# EAGLE design AutoPilotBoard (EAGLE 7.4.0)
DESIGNER: Ye Wang; VERSION: 1.1
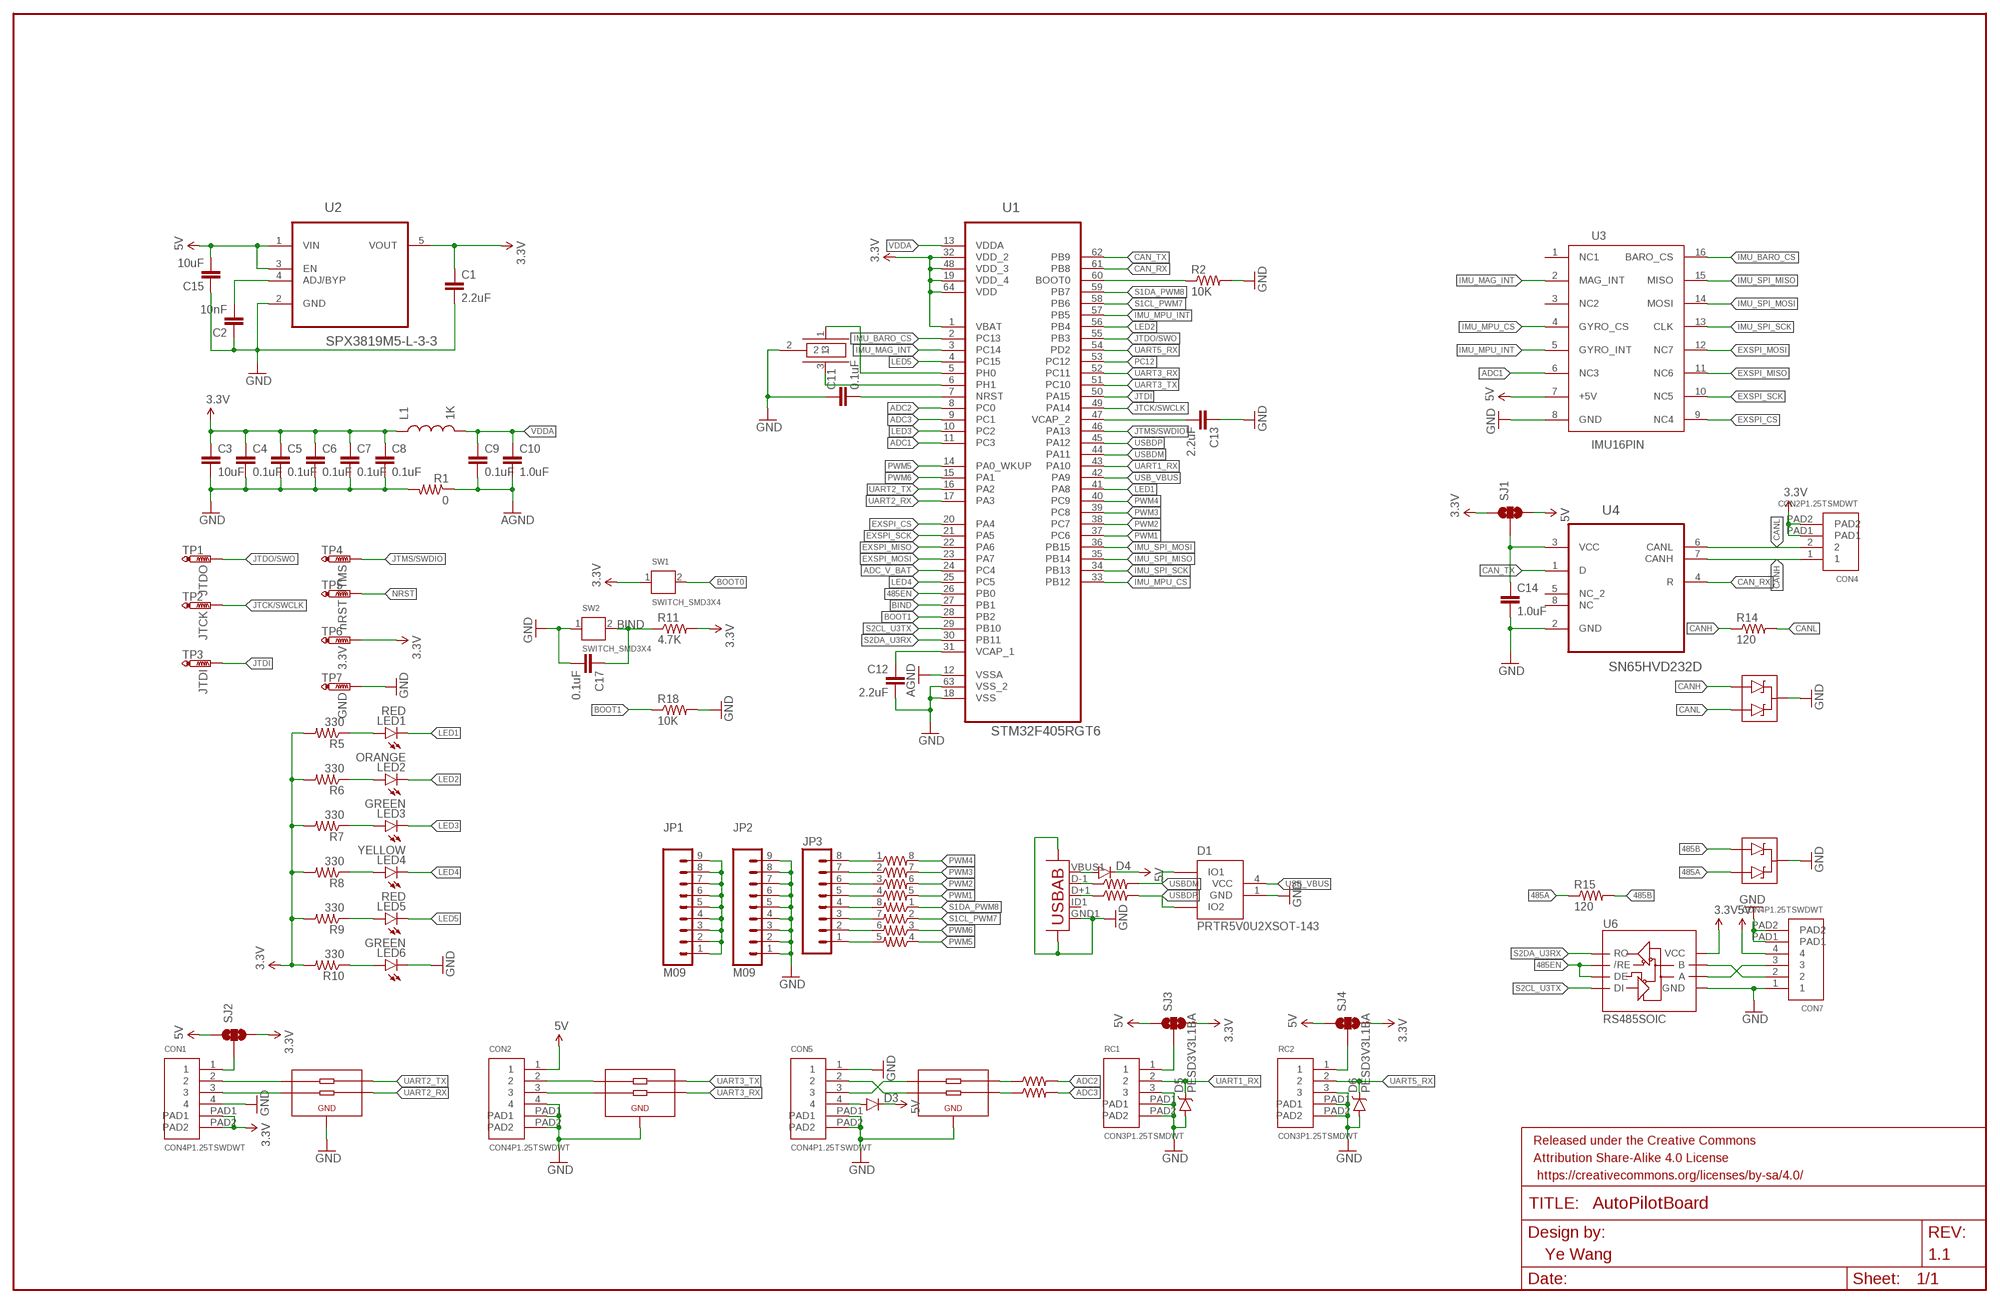
[diagram p0: schematic, sheet 1]

## Parts
C1  2.2uF  2.2UF-10V-20%(0603)  [0603-CAP]
C2  10nF  10NF/10000PF-50V-10%(0603)  [0603-CAP]
C3  10uF  CAP0805W  [0805-CAP]
C4  0.1uF  0.1UF-25V-5%(0603)  [0603-CAP]
C5  0.1uF  0.1UF-25V-5%(0603)  [0603-CAP]
C6  0.1uF  0.1UF-25V-5%(0603)  [0603-CAP]
C7  0.1uF  0.1UF-25V-5%(0603)  [0603-CAP]
C8  0.1uF  0.1UF-25V-5%(0603)  [0603-CAP]
C9  0.1uF  0.1UF-25V-5%(0603)  [0603-CAP]
C10  1.0uF  1.0UF-16V-10%(0603)  [0603-CAP]
C11  0.1uF  0.1UF-25V-5%(0603)  [0603-CAP]
C12  2.2uF  2.2UF-10V-20%(0603)  [0603-CAP]
C13  2.2uF  2.2UF-10V-20%(0603)  [0603-CAP]
C14  1.0uF  1.0UF-16V-10%(0603)  [0603-CAP]
C15  10uF  CAP1206  [1206]
C17  0.1uF  0.1UF-25V-5%(0603)  [0603-CAP]
CON1  CON4P1.25TSWDWT  [1.25T4P]
CON2  CON4P1.25TSWDWT  [1.25T4P]
CON4  CON2P1.25TSMDWT  [1.25T2P]
CON5  CON4P1.25TSWDWT  [1.25T4P]
CON7  CON4P1.25TSWDWT  [1.25T4P]
D1  PRTR5V0U2XSOT-143  [SOT-143B]
D2  PESD1CAN  MMBZ27VCLT1SOT23-3  [SOT23-3]
D3  DIODESOD123  [SOD-123]
D4  DIODESOD123  [SOD-123]
D5  PESD3V3L1BA  DIODE-SCHOTTKY-PMEG4005EJ  [SOD-323]
D6  PESD3V3L1BA  DIODE-SCHOTTKY-PMEG4005EJ  [SOD-323]
D7  SM712  MMBZ27VCLT1SOT23-3  [SOT23-3]
FIL1  IP4256CZ5-W  [SOT65P210X110-5N]
FIL2  IP4256CZ5-W  [SOT65P210X110-5N]
FIL3  IP4256CZ5-W  [SOT65P210X110-5N]
FRAME1  FRAME-LEDGERNO_PKG  [DUMMY]
JP1  M09  [1X09]
JP2  M09  [1X09]
JP3  M08RND  [1X08_ROUND]
L1  1K  INDUCTOR0603  [0603]
LED1  RED  LED0603  [LED-0603]
LED2  ORANGE  LED0603  [LED-0603]
LED3  GREEN  LED0603  [LED-0603]
LED4  YELLOW  LED0603  [LED-0603]
LED5  RED  LED0603  [LED-0603]
LED6  GREEN  LED0603  [LED-0603]
R1  0  RESISTOR0603-RES  [0603-RES]
R2  10K  10KOHM-1/10W-1%(0603)0603  [0603-RES]
R3  22  22OHM1/10W1%(0603)  [0603-RES]
R4  22  22OHM1/10W1%(0603)  [0603-RES]
R5  330  330OHM1/10W1%(0603)  [0603-RES]
R6  330  330OHM1/10W1%(0603)  [0603-RES]
R7  330  330OHM1/10W1%(0603)  [0603-RES]
R8  330  330OHM1/10W1%(0603)  [0603-RES]
R9  330  330OHM1/10W1%(0603)  [0603-RES]
R10  330  330OHM1/10W1%(0603)  [0603-RES]
R11  4.7K  4.7KOHM-1/10W-1%(0603)  [0603-RES]
R12  1K  RESISTOR-ARRAY0603-ARV  [0603-ARV]
R13  1K  RESISTOR-ARRAY0603-ARV  [0603-ARV]
R14  120  RESISTOR0603-RES  [0603-RES]
R15  120  RESISTOR0603-RES  [0603-RES]
R16  1K  1KOHM-1/10W-1%(0603)  [0603-RES]
R17  1K  1KOHM-1/10W-1%(0603)  [0603-RES]
R18  10K  10KOHM-1/10W-1%(0603)0603  [0603-RES]
RC1  CON3P1.25TSMDWT  [1.25T3P]
RC2  CON3P1.25TSMDWT  [1.25T3P]
SJ1  SOLDERJUMPER_2WAYS  [SJ_3]
SJ2  SOLDERJUMPER_2WAYS  [SJ_3]
SJ3  SOLDERJUMPER_2WAYS  [SJ_3]
SJ4  SOLDERJUMPER_2WAYS  [SJ_3]
SW1  SWITCH_SMD3X4  [SWITCH3X4_SMD]
SW2  SWITCH_SMD3X4  [SWITCH3X4_SMD]
TP1  PTR1B1,27  [B1,27]
TP2  PTR1B1,27  [B1,27]
TP3  PTR1B1,27  [B1,27]
TP4  PTR1B1,27  [B1,27]
TP5  PTR1B1,27  [B1,27]
TP6  PTR1B1,27  [B1,27]
TP7  PTR1B1,27  [B1,27]
U1  STM32F405RGT6  [QFP50P1200X1200X160-64N]
U2  SPX3819M5-L-3-3  [SOT95P280X145-5N]
U3  IMU16PIN  [SMD23X23]
U4  SN65HVD232D  [SOIC127P600X175-8N]
U5  USB-ABCONN-11794  [USB-AB-MICRO-SMD_V03]
U6  RS485SOIC  [SO08]
X1  CSTCE8M00G52-R0  [CSTCE_M_G]

## Nets
3.3V: C1.1 C3.P$1 C4.1 C5.1 C6.1 C7.1 C8.1 CON1.PAD1 CON1.PAD2 CON4.PAD1 CON4.PAD2 L1.1 R5.2 R6.2 R7.2 R8.2 R9.2 R10.2 R11.2 SJ1.1 SJ2.3 SJ3.3 SJ4.3 SW1.1 TP6.TP U1.1(VBAT) U1.19(VDD_4) U1.32(VDD_2) U1.48(VDD_3) U1.64(VDD) U2.5(VOUT) U6.8(VCC)
5V: C15.2 CON2.1 CON7.4 D3.C D4.C SJ1.3 SJ2.1 SJ3.1 SJ4.1 U2.1(VIN) U2.3(EN) U3.7(+5V)
485A: CON7.3 D7.2(A2) R15.1 U6.6(A)
485B: CON7.2 D7.1(A1) R15.2 U6.7(B)
485EN: U1.26(PB0) U6.2(/RE) U6.3(DE)
ADC1: U1.11(PC3) U3.6(NC3)
ADC2: R16.2 U1.8(PC0)
ADC3: R17.2 U1.9(PC1)
ADC_V_BAT: U1.24(PC4)
AGND: C9.2 C10.2 R1.1 U1.12(VSSA)
BIND: C17.1 R11.1 SW2.2 U1.27(PB1)
BOOT0: R2.1 SW1.2 U1.60(BOOT0)
BOOT1: R18.1 U1.28(PB2)
CAN_RX: U1.61(PB8) U4.4(R)
CAN_TX: U1.62(PB9) U4.1(D)
CANH: CON4.1 D2.1(A1) R14.1 U4.7(CANH)
CANL: CON4.2 D2.2(A2) R14.2 U4.6(CANL)
EXSPI_CS: U1.20(PA4) U3.9(NC4)
EXSPI_MISO: U1.22(PA6) U3.11(NC6)
EXSPI_MOSI: U1.23(PA7) U3.12(NC7)
EXSPI_SCK: U1.21(PA5) U3.10(NC5)
GND: C1.2 C2.1 C3.P$2 C4.2 C5.2 C6.2 C7.2 C8.2 C11.1 C12.2 C13.1 C14.2 C15.1 C17.2 CON1.4 CON2.4 CON2.PAD1 CON2.PAD2 CON5.1 CON5.PAD1 CON5.PAD2 CON7.1 CON7.PAD1 CON7.PAD2 D1.1(GND) D2.3(C) D5.A D6.A D7.3(C) FIL1.2 FIL2.2 FIL3.2 JP2.1 JP2.2 JP2.3 JP2.4 JP2.5 JP2.6 JP2.7 JP2.8 JP2.9 LED6.C R1.2 R2.2 R18.2 RC1.3 RC1.PAD1 RC1.PAD2 RC2.3 RC2.PAD1 RC2.PAD2 SW2.1 TP7.TP U1.18(VSS) U1.63(VSS_2) U2.2(GND) U3.8(GND) U4.2(GND) U5.CON1(SHL1) U5.CON2(SHL2) U5.GND1(GND) U6.5(GND) X1.2
IMU_BARO_CS: U1.2(PC13) U3.16(BARO_CS)
IMU_MAG_INT: U1.3(PC14) U3.2(MAG_INT)
IMU_MPU_CS: U1.33(PB12) U3.4(GYRO_CS)
IMU_MPU_INT: U1.57(PB5) U3.5(GYRO_INT)
IMU_SPI_MISO: U1.35(PB14) U3.15(MISO)
IMU_SPI_MOSI: U1.36(PB15) U3.14(MOSI)
IMU_SPI_SCK: U1.34(PB13) U3.13(CLK)
JTCK/SWCLK: TP2.TP U1.49(PA14)
JTDI: TP3.TP U1.50(PA15)
JTDO/SWO: TP1.TP U1.55(PB3)
JTMS/SWDIO: TP4.TP U1.46(PA13)
LED1: LED1.C U1.41(PA8)
LED2: LED2.C U1.56(PB4)
LED3: LED3.C U1.10(PC2)
LED4: LED4.C U1.25(PC5)
LED5: LED5.C U1.4(PC15)
N$1: C14.1 SJ1.2 U4.3(VCC)
N$2: U1.6(PH1) X1.3
N$3: C2.2 U2.4(ADJ/BYP)
N$4: U1.5(PH0) X1.1
N$5: C12.1 U1.31(VCAP_1)
N$6: C13.2 U1.47(VCAP_2)
N$7: R3.1 U5.D-1(D-)
N$8: R4.1 U5.D+1(D+)
N$9: LED1.A R5.1
N$10: LED3.A R7.1
N$11: LED4.A R8.1
N$12: LED5.A R9.1
N$13: LED2.A R6.1
N$14: CON5.3 FIL1.1
N$15: RC1.1 SJ3.2
N$16: CON5.2 FIL1.3
N$17: JP3.5 R12.4
N$18: JP3.6 R12.3
N$19: JP3.7 R12.2
N$20: JP3.8 R12.1
N$21: JP3.4 R13.8
N$22: JP3.3 R13.7
N$23: JP3.2 R13.6
N$24: LED6.A R10.1
N$25: JP3.1 R13.5
N$26: FIL1.5 R16.1
N$27: FIL1.4 R17.1
N$28: CON1.2 FIL2.1
N$29: CON1.3 FIL2.3
N$30: CON2.3 FIL3.4
N$31: CON2.2 FIL3.5
N$32: CON5.4 D3.A
N$33: CON1.1 SJ2.2
N$34: RC2.1 SJ4.2
NRST: C11.2 TP5.TP U1.7(NRST)
PC12: U1.53(PC12)
PWM1: R12.5 U1.37(PC6)
PWM2: R12.6 U1.38(PC7)
PWM3: R12.7 U1.39(PC8)
PWM4: R12.8 U1.40(PC9)
PWM5: R13.4 U1.14(PA0_WKUP)
PWM6: R13.3 U1.15(PA1)
S1CL_PWM7: R13.2 U1.58(PB6)
S1DA_PWM8: R13.1 U1.59(PB7)
S2CL_U3TX: U1.29(PB10) U6.4(DI)
S2DA_U3RX: U1.30(PB11) U6.1(RO)
SRV_COM: JP1.1 JP1.2 JP1.3 JP1.4 JP1.5 JP1.6 JP1.7 JP1.8 JP1.9
UART1_RX: D5.C RC1.2 U1.43(PA10)
UART2_RX: FIL2.4 U1.17(PA3)
UART2_TX: FIL2.5 U1.16(PA2)
UART3_RX: FIL3.3 U1.52(PC11)
UART3_TX: FIL3.1 U1.51(PC10)
UART5_RX: D6.C RC2.2 U1.54(PD2)
USB_VBUS: D1.4(VCC) D4.A U1.42(PA9) U5.VBUS1(VBUS)
USBDM: D1.2(IO1) R3.2 U1.44(PA11)
USBDP: D1.3(IO2) R4.2 U1.45(PA12)
VDDA: C9.1 C10.1 L1.2 U1.13(VDDA)
Unconnected: U3.1(NC1) U3.3(NC2) U4.5(NC_2) U4.8(NC) U5.ID1(USBID)

## Library data of the parts
C1 C12 C13 = SparkFun-Capacitors:2.2UF-10V-20%(0603): CAP-07888; PROD_ID: CAP-07888
C2 = SparkFun-Capacitors:10NF/10000PF-50V-10%(0603): CAP-00867; PROD_ID: CAP-00867
C3 C15 = SparkFun-Capacitors:CAP: Capacitor Standard 0603 ceramic capacitor, and 0.1" leaded capacitor.
C4-C9 C11 C17 = SparkFun-Capacitors:0.1UF-25V-5%(0603): CAP-08604; PROD_ID: CAP-08604
C10 C14 = SparkFun-Capacitors:1.0UF-16V-10%(0603): CAP-00868; PROD_ID: CAP-00868
CON1 CON2 CON5 CON7 = szjlc:CON4P
CON4 = szjlc:CON2P
D1 = Volks73-NXPSemiconductors:PRTR5V0U2X?: I2C-Bus EDS Protection Ulta low capacitance double rail-to-rail ESD protection diode Documentation Datasheet <http://www.nxp.com/documents/data_sheet/PRTR5V0U2X.pdf> General Description Ultra low capacitance rail-to-rail ElectroStatic Discharge (ESD) protection diode in a small SOT143B Surface-Mounted Device (SMD) plastic package designed to protect two Hi-Speed data lines or high-frequency signal lines from the damage caused by ESD and other transients. PRTR5V0U2X incorporates two pairs of ultra low capacitance rail-to-rail diodes as well as an additional ESD protection diode to ensure signal line protection even if no supply voltage is available. Features ESD protection of two Hi-Speed data lines or high-frequency signal lines Ultra low input/output to ground capacitance: C(I/O-GND) = 1 pF ESD protection up to 8kV IEC 61000-4-2, level 4 (ESD) Very low clamping voltage due to an integrated additional ESD protection diode Very low reverse current Small SMD plastic package Applications USB 2.0 ports Digital Video Interface (DVI)/High Definition Multimedia Interface (HDMI) interfaces Mobile and cordless phones Personal Digital Assistants (PDA) Digital Cameras Wide Area Network (WAN) / Local Area Network (LAN) systems PCs, notebooks, printers, and other PC peripherals; APPLICATIONS: General Purpose; BIDIRECTIONAL_CHANNELS: 2; CAPACITANCE: 1pF @ 1MHz; CURRENT_PEAK_PULSE: -; DESCRIPTION: TVS DIODE 5.5VWM SOT143B; DOCUMENTATION_LINK: <a href="http://www.nxp.com/documents/data_sheet/PRTR5V0U2X.pdf">Datasheet</a>; DOCUMENTATION_URL: http://www.nxp.com/documents/data_sheet/PRTR5V0U2X.pdf; MANUFACTURER: NXP Semiconductors; MOUNTING_TYPE: Surface Mount; OPERATING_TEMPERATURE: -40C ~ 85C; PART_NUMBER: PRTR5V0U2X,215; POWER-PEAK_PULSE: -; POWER_LINE_PROTECTION: Yes; SUPPLIER_ITEM_LINK: <a href="http://www.digikey.com/product-detail/en/PRTR5V0U2X,215/568-4140-1-ND/1589981">Details</a>; SUPPLIER_ITEM_NUMBER: 568-4140-1-ND; SUPPLIER_ITEM_URL: http://www.digikey.com/product-detail/en/PRTR5V0U2X,215/568-4140-1-ND/1589981; SUPPLIER_LINK: <a href="http://www.digikey.com">Home Page</a>; SUPPLIER_NAME: Digi-Key; SUPPLIER_URL: http://www.digikey.com; TYPE: Steering (Rail to Rail); UNIDIRECTIONAL_CHANNELS: -; VOLTAGE_BREAKDOWN: 6V; VOLTAGE_CLAMPING: -; VOLTAGE_REVERSE: 5.5V
D2 D7 = SparkFun-DiscreteSemi:MMBZ27VCLT1: 40W Zener-diode transient voltage suppressor (ESD protection)
D3 D4 = SparkFun-DiscreteSemi:DIODE: Diode These are standard reverse protection diodes and small signal diodes. SMA package can handle up to about 1A. SOD-323 can handle about 200mA. What the SOD-323 package when ordering, there are some mfgs out there that are 5-pin packages.
D5 D6 = SparkFun-DiscreteSemi:DIODE-SCHOTTKY: Schottky diodes in SFE's production catalog BAT20J 1A 23V 0.62Vf RB751 120mA 40V 0.37Vf PMEG4005EJ 0.5A 40V 0.42Vf MBRA140 1A 40V 0.5Vf B340A 3A 40V SMA; PROD_ID: PESD3V3L1BA; VALUE: PMEG4005EJ
FIL1-FIL3 = Oles_komponentbibliotek:IP4256CZ5-W: Dual-channel passive filter network with ESD protection
FRAME1 = SparkFun-Aesthetics:FRAME-LEDGER: Schematic Frame Standard 11x14 US Ledger frame
JP1 JP2 = SparkFun-Connectors:M09: Header 9 Standard 9-pin 0.1" header. Use with straight break away headers (SKU : PRT-00116), right angle break away headers (PRT-00553), swiss pins (PRT-00743), machine pins (PRT-00117), and female headers (PRT-00115).
JP3 = SparkFun-Connectors:M08: Header 8 Standard 8-pin 0.1" header. Use with straight break away headers (SKU : PRT-00116), right angle break away headers (PRT-00553), swiss pins (PRT-00743), machine pins (PRT-00117), and female headers (PRT-00115).
L1 = SparkFun-Passives:INDUCTOR: Inductors Basic Inductor/Choke - 0603 and 1206. Footprints are not proven and vary greatly between part numbers. SRN6045- 33uH, 20% 1.4A SDR0403-560KL - 56uH, 10%, 500mA RMS/740mA peak
LED1-LED6 = SparkFun-LED:LED: LEDs Standard schematic elements and footprints for 5mm, 3mm, 1206, and 0603 sized LEDs. 5mm - Spark Fun Electronics SKU : COM-00529 (and others)
R1 R14 R15 = SparkFun-Resistors:RESISTOR: Resistor Basic schematic elements and footprints for 0603, 1206, and PTH resistors.
R2 R18 = SparkFun-Resistors:10KOHM-1/10W-1%(0603): RES-00824; PROD_ID: RES-00824
R3 R4 = SparkFun-Resistors:22OHM1/10W1%(0603): RES-08698; PROD_ID: RES-08698
R5-R10 = SparkFun-Resistors:330OHM1/10W1%(0603): RES-00818; PROD_ID: RES-00818
R11 = SparkFun-Resistors:4.7KOHM-1/10W-1%(0603): RES-07857; PROD_ID: RES-07857
R12 R13 = SparkFun-Resistors:RESISTOR-ARRAY: Array Chip Resistor Source: RS Component / Phycomp
R16 R17 = SparkFun-Resistors:1KOHM-1/10W-1%(0603): RES-07856; PROD_ID: RES-07856
RC1 RC2 = szjlc:CON3P
SJ1-SJ4 = SparkFun-Retired:SOLDERJUMPER_2WAY: Solder Jumper 2 way solder jumper
SW1 SW2 = szjlc:SWITCH_SMD
TP1 = testpad:PTR1: TEST PIN; TP_SIGNAL_NAME: JTDO
TP2 = testpad:PTR1: TEST PIN; TP_SIGNAL_NAME: JTCK
TP3 = testpad:PTR1: TEST PIN; TP_SIGNAL_NAME: JTDI
TP4 = testpad:PTR1: TEST PIN; TP_SIGNAL_NAME: JTMS
TP5 = testpad:PTR1: TEST PIN; TP_SIGNAL_NAME: nRST
TP6 = testpad:PTR1: TEST PIN; TP_SIGNAL_NAME: 3.3V
TP7 = testpad:PTR1: TEST PIN; TP_SIGNAL_NAME: GND
U1 = stm32f405rgt6:STM32F405RGT6: IC, MCU, 32BIT, 1MB FLASH, 64LQFP; MPN: STM32F405RGT6; OC_FARNELL: 2064363; OC_NEWARK: 73T2329; PACKAGE: 64LQFP; SUPPLIER: STMicroelectronics
U2 = szjlc:SPX3819M5-L-3-3: 500mA, LOW-NOISE LDO VOLTAGE REGULATOR; MPN: SPX3819M5-L-3-3; OC_FARNELL: 1831949; OC_NEWARK: 23R9702; PACKAGE: SOT-23-5; SUPPLIER: EXAR
U3 = imu:IMU
U4 = ti_misc:SN65HVD232D: 3.3-V CAN TRANSCEIVERS; MPN: SN65HVD232D; OC_FARNELL: 1103107; OC_NEWARK: 35K4890; PACKAGE: SOIC-8; SUPPLIER: Texas Instruments
U5 = SparkFun-Connectors:USB-AB: This is a USB AB connector that is compatible with USB OTG. i.e. this connector can serve as a host or device; PROD_ID: CONN-11794
U6 = SparkFun-DigitalIC:RS485: RS485 transceiver
X1 = murata:CSTCE8M00G52-R0

## Board
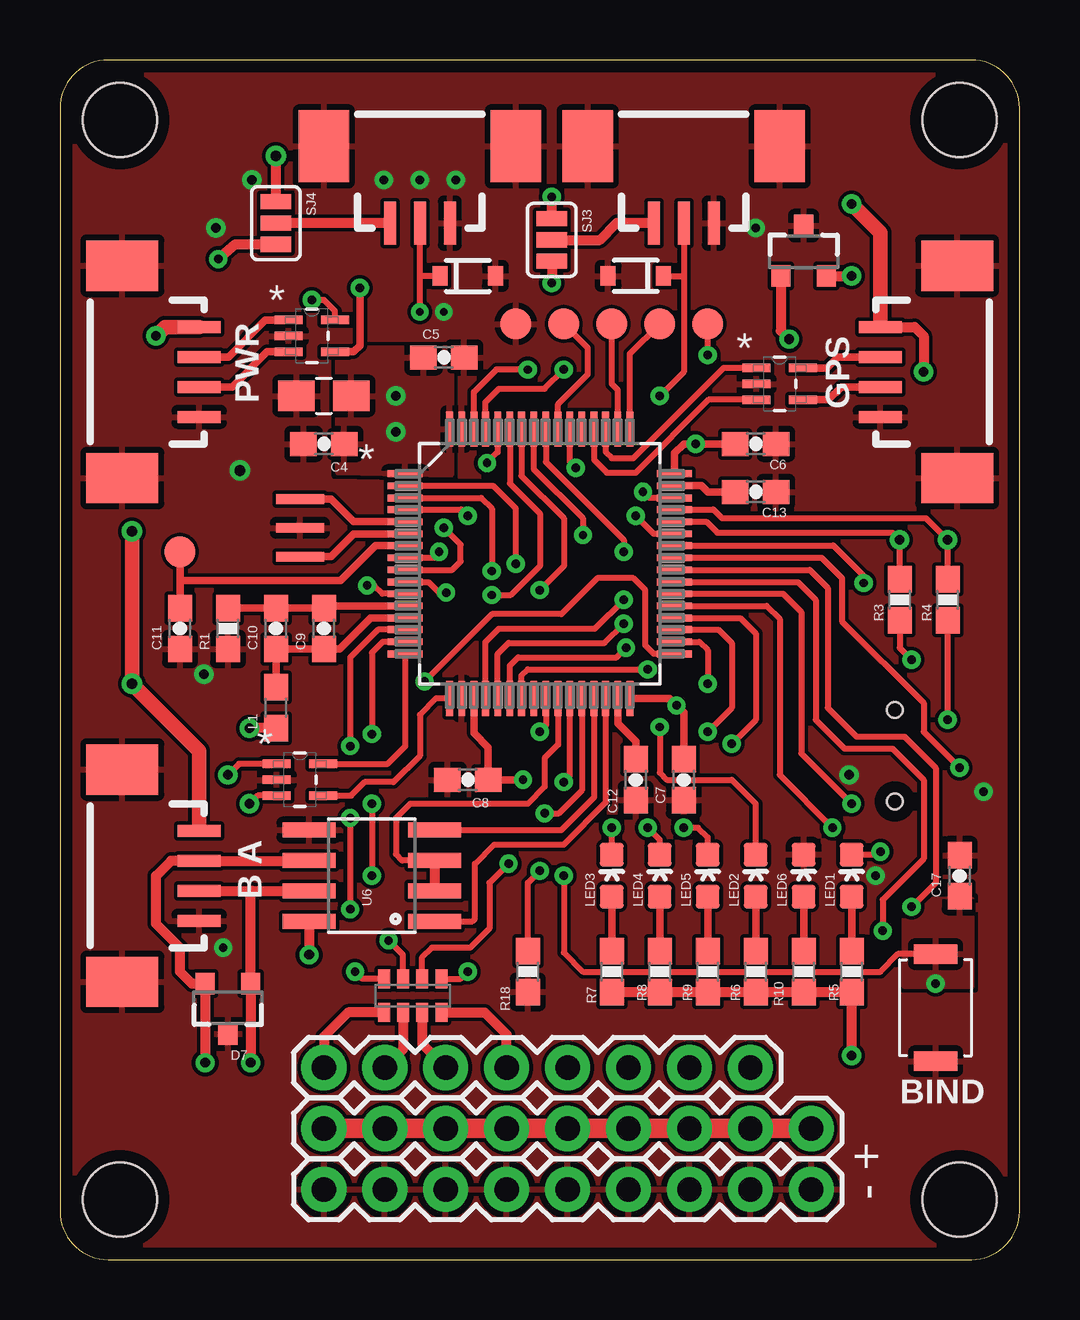
[diagram p1: board, top side]
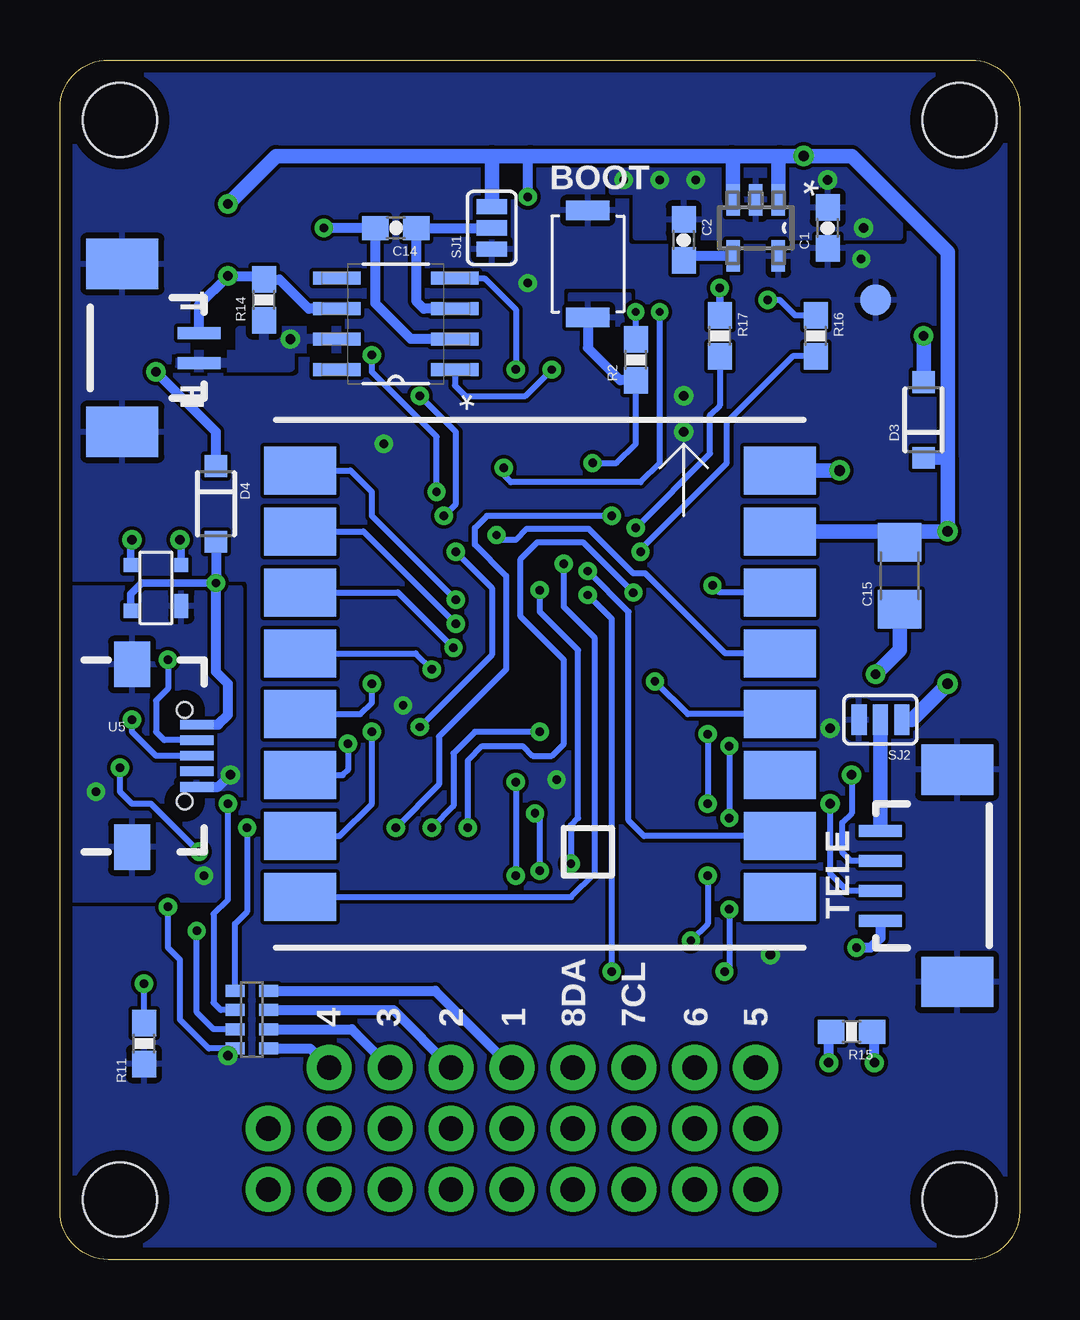
[diagram p2: board, bottom side, seen from below]

Size 40 x 50 mm. Coordinates in mm from the lower left corner, seen from the top.
Outline: 40,2 40,48 arc90 38,50 2,50 arc90 0,48 0,2 arc90 2,0 38,0 arc90 40,2
Copper layers (1*16): Top 0.035mm / dielectric 1.5mm / Bottom 0.035mm
Design rules "default *": minimum track width 8mil, minimum drill 0.3mm, track to track 6mil, track to pad 6mil, pad to pad 6mil, via to via 6mil, smd to smd 6mil, copper to edge 20mil, drill to drill 6mil, minimum pad ring 10mil, minimum via ring 8mil, stop-mask expansion 4mil, vias tented up to drill 0.5mm, thermal gap 10mil
Holes 3.1 mm at 2.5,2.5 37.5,2.5 37.5,47.5 2.5,47.5

### Footprints (pad centres in the part's own frame; a part is rotated, then mirrored left to right if it is on the bottom)
0603-CAP = smd 1.1 x 1: 1 -0.85,0; 2 0.85,0
0805-CAP = smd 1.524 x 1.27: P$1 -1.143,0; P$2 1.143,0
1206 = smd 1.6 x 1.8: 1 -1.4,0; 2 1.4,0
1.25T4P = smd 0.5 x 1.8: 1 -1.875,-1.8; 2 -0.625,-1.8; 3 0.625,-1.8; 4 1.875,-1.8 | smd 2.1 x 3: PAD1 -4.425,1.4; PAD2 4.425,1.4
1.25T2P = smd 0.5 x 1.8: 1 -0.625,-1.8; 2 0.625,-1.8 | smd 2.1 x 3: PAD1 -3.5,1.4; PAD2 3.5,1.4
SOT-143B = smd 1 x 0.6: 1 -0.75,-1.05 | smd 0.6 x 0.6: 2 0.95,-1.05; 3 0.95,1.05; 4 -0.95,1.05
SOT23-3 = smd 0.8 x 0.9: 1 -0.95,-1; 2 0.95,-1; 3 0,1.1
SOD-123 = smd 0.9 x 0.95: A 1.575,0; C -1.575,0
SOD-323 = smd 0.63 x 0.83: A 1.15,0; C -1.15,0
SOT65P210X110-5N = smd 1.168 x 0.356: 1 -0.965,0.66; 2 -0.965,0; 3 -0.965,-0.66; 4 0.965,-0.66; 5 0.965,0.66
1X09 = drill 1.016 pad 1.88: 1 0,0; 2 2.54,0; 3 5.08,0; 4 7.62,0; 5 10.16,0; 6 12.7,0; 7 15.24,0; 8 17.78,0; 9 20.32,0
1X08_ROUND = drill 1.016 pad 1.88: 1 0,0; 2 2.54,0; 3 5.08,0; 4 7.62,0; 5 10.16,0; 6 12.7,0; 7 15.24,0; 8 17.78,0
0603 = smd 1.1 x 1: 1 -0.85,0; 2 0.85,0
LED-0603 = smd 1 x 1: A 0,-0.877; C 0,0.877
0603-RES = smd 1.1 x 1: 1 -0.85,0; 2 0.85,0
0603-ARV = smd 0.5 x 0.8: 1 -1.2,-0.7; 2 -0.4,-0.7; 3 0.4,-0.7; 4 1.2,-0.7; 5 1.2,0.7; 6 0.4,0.7; 7 -0.4,0.7; 8 -1.2,0.7
1.25T3P = smd 0.5 x 1.8: 1 -1.25,-1.8; 2 0,-1.8; 3 1.25,-1.8 | smd 2.1 x 3: PAD1 -4,1.4; PAD2 4,1.4
SJ_3 = smd 0.635 x 1.27: 1 -0.889,0; 2 0,0; 3 0.889,0
SWITCH3X4_SMD = smd 0.8 x 1.8: 1 -2.23,0; 2 2.23,0
B1,27 = smd 1.27 x 1.27: TP 0,0
QFP50P1200X1200X160-64N = smd 1.473 x 0.279: 1 -5.613,3.759; 2 -5.613,3.251; 3 -5.613,2.743; 4 -5.613,2.261; 5 -5.613,1.753; 6 -5.613,1.245; 7 -5.613,0.762; 8 -5.613,0.254; 9 -5.613,-0.254; 10 -5.613,-0.762; 11 -5.613,-1.245; 12 -5.613,-1.753; 13 -5.613,-2.261; 14 -5.613,-2.743; 15 -5.613,-3.251; 16 -5.613,-3.759; 33 5.613,-3.759; 34 5.613,-3.251; 35 5.613,-2.743; 36 5.613,-2.261; 37 5.613,-1.753; 38 5.613,-1.245; 39 5.613,-0.762; 40 5.613,-0.254; 41 5.613,0.254; 42 5.613,0.762; 43 5.613,1.245; 44 5.613,1.753; 45 5.613,2.261; 46 5.613,2.743; 47 5.613,3.251; 48 5.613,3.759 | smd 0.279 x 1.473: 17 -3.759,-5.613; 18 -3.251,-5.613; 19 -2.743,-5.613; 20 -2.261,-5.613; 21 -1.753,-5.613; 22 -1.245,-5.613; 23 -0.762,-5.613; 24 -0.254,-5.613; 25 0.254,-5.613; 26 0.762,-5.613; 27 1.245,-5.613; 28 1.753,-5.613; 29 2.261,-5.613; 30 2.743,-5.613; 31 3.251,-5.613; 32 3.759,-5.613; 49 3.759,5.613; 50 3.251,5.613; 51 2.743,5.613; 52 2.261,5.613; 53 1.753,5.613; 54 1.245,5.613; 55 0.762,5.613; 56 0.254,5.613; 57 -0.254,5.613; 58 -0.762,5.613; 59 -1.245,5.613; 60 -1.753,5.613; 61 -2.261,5.613; 62 -2.743,5.613; 63 -3.251,5.613; 64 -3.759,5.613
SOT95P280X145-5N = smd 1.321 x 0.559: 1 -1.168,0.94; 2 -1.168,0; 3 -1.168,-0.94; 4 1.168,-0.94; 5 1.168,0.94
SMD23X23 = smd 3 x 2: 1 -10,8.89; 2 -10,6.35; 3 -10,3.81; 4 -10,1.27; 5 -10,-1.27; 6 -10,-3.81; 7 -10,-6.35; 8 -10,-8.89; 9 10,-8.89; 10 10,-6.35; 11 10,-3.81; 12 10,-1.27; 13 10,1.27; 14 10,3.81; 15 10,6.35; 16 10,8.89
SOIC127P600X175-8N = smd 1.981 x 0.559: 1 -2.464,1.905; 2 -2.464,0.635; 3 -2.464,-0.635; 4 -2.464,-1.905; 5 2.464,-1.905; 6 2.464,-0.635; 7 2.464,0.635; 8 2.464,1.905
USB-AB-MICRO-SMD_V03 = smd 1.5 x 1.9: CON1 0,3.81; CON2 0,-3.81 | smd 1.4 x 0.4: D+1 2.7,0; D-1 2.7,0.65; GND1 2.7,-1.3; ID1 2.7,-0.65; VBUS1 2.7,1.3 | hole 0.65: 2.2,1.9; 2.2,-1.9
SO08 = smd 0.61 x 2.21: 1 -1.905,-2.616; 2 -0.635,-2.616; 3 0.635,-2.616; 4 1.905,-2.616; 5 1.905,2.616; 6 0.635,2.616; 7 -0.635,2.616; 8 -1.905,2.616
CSTCE_M_G = smd 0.4 x 2: 1 -1.2,0; 2 0,0; 3 1.2,0

### Placement (x,y rotation side)
C1  8,43 90 bottom
C2  14,42.5 270 bottom
C3  11,36 180 top
C4  11,34 180 top
C5  16,37.6 0 top
C6  29,34 0 top
C7  26,20 270 top
C8  17,20 180 top
C9  11,26.3 90 top
C10  9,26.3 90 top
C11  5,26.3 90 top
C12  24,20 270 top
C13  29,32 180 top
C14  26,43 180 bottom
C15  5,28.5 90 bottom
C17  37.5,16 90 top
CON1  4,16 270 bottom
CON2  36,37 270 top
CON4  36,38 90 bottom
CON5  4,37 90 top
CON7  4,16 90 top
D1  36,28 90 bottom
D2  31,42 0 top
D3  4,35 90 bottom
D4  33.5,31.5 270 bottom
D5  24,41 180 top
D6  17,41 0 top
D7  7,10.5 180 top
FIL1  10.5,38.5 0 top
FIL2  10,20 0 top
FIL3  30,36.5 0 top
FRAME1  0,-1 0 top
JP1  11,5.46 0 top
JP2  11,2.92 0 top
JP3  11,8 0 top
L1  9,23 90 top
LED1  33,16 0 top
LED2  29,16 0 top
LED3  23,16 0 top
LED4  25,16 0 top
LED5  27,16 0 top
LED6  31,16 0 top
R1  7,26.3 270 top
R2  16,37.5 90 bottom
R3  35,27.5 90 top
R4  37,27.5 90 top
R5  33,12 270 top
R6  29,12 270 top
R7  23,12 270 top
R8  25,12 270 top
R9  27,12 270 top
R10  31,12 270 top
R11  36.5,9 270 bottom
R12  32,10 90 bottom
R13  14.7,11 180 top
R14  31.5,40 90 bottom
R15  7,9.5 180 bottom
R16  8.5,38.5 270 bottom
R17  12.5,38.5 270 bottom
R18  19.5,12 270 top
RC1  26,45 0 top
RC2  15,45 0 top
SJ1  22,43 90 bottom
SJ2  5.8,22.5 180 bottom
SJ3  20.5,42.5 270 top
SJ4  9,43.2 270 top
SW1  18,41.5 270 bottom
SW2  36.5,10.5 90 top
TP1  21,39 0 top
TP2  25,39 0 top
TP3  23,39 0 top
TP4  27,39 0 top
TP5  5,29.5 0 top
TP6  6,40 0 bottom
TP7  19,39 0 top
U1  20,29 0 top
U2  11,43 270 bottom
U3  20,24 180 bottom
U4  26,39 180 bottom
U5  37,21 0 bottom
U6  13,16 90 top
X1  10,30.5 270 top

### Tracks (layer width: path | path; a pad name or v marks a point on that pad's centre or on a via)
3.3V  (via drill 0.35, 0.4)
  Top 0.305: U1.48 25.61,33.61 26,34 v26.5,34 C6.1 | U1.32 25.41,23.39 v25.7,23.1 26,22.8 C7.1 | U1.19 17.26,21.94 17.85,21.35 C8.1 v19.3,20
  Top 0.406: L1.1 v7.9,22.15 | U6.8 v10.38,12.7 | R7.2 R8.2 R9.2 R6.2 R10.2 R5.2 v33,8.5 | SJ4.3 7.31,42.31 v6.6,41.7 | SJ3.3 v20.5,40.7
  other vias: 14,36 14,34.5
  pour Bottom (rank 2): -1,-1 41,-1 41,51 -1,51
  pour Top: 11.6,32.8 11.6,38 16.3,38 16.3,32.7
5V  (via drill 0.35, 0.4, 0.45)
  Top 0.406: v36,37 36,38.5 35.62,38.88 CON2.1 34.2,39 | SJ4.1 v9,46 | SJ3.1 v20.5,44.3 | CON7.4 5.8,18.1
  Top 0.61: v33,44 34.2,42.8 34.2,39 | v3,30.35 v3,24 5.8,21.2 5.8,18.1
  Bottom 0.406: D4.C 33.5,34.5 v36,37 | v20.5,44.3 20.5,45.9 20.4,46
  Bottom 0.61: v33,44 31,46 22,46 | 3,33.42 3,42 7,46 v9,46 10,46 | D3.C 3,33.42 | 22,46 20.4,46 12,46 | 12,46 10,46 | SJ1.3 22,46 | U3.7 5,30.35 | C15.2 5,30.35 | U2.1 10.06,45.94 10,46 | U2.3 11.94,45.94 12,46 | SJ2.1 4.5,22.5 v3,24 | 5,30.35 v3,30.35 3,33.42
485A  (via drill 0.4)
  Top 0.406: U6.6 10.37,16.62 CON7.3 4.62,16.62 4,16 4,14 5,13 5,12 5.5,11.5 D7.2 v6.05,8.2
  Bottom 0.406: v6.05,8.2 6.05,9.4 R15.1
485B  (via drill 0.4)
  Top 0.406: CON7.2 8,15.38 | 8,15.38 U6.7 | 8,15.38 7.95,15.32 D7.1 v7.95,8.2
  Bottom 0.406: v7.95,8.2 7.95,9.4 R15.2
485EN
  Top 0.254: U6.3 14.27,16.64 14,16.9 14,18.4 14.6,19 19.5,19 20.2,19.7 20.2,20.9 20.76,21.46 U1.26
  Top 0.406: U6.3 U6.2
ADC1  (via drill 0.35)
  Top 0.254: v12.8,28.1 13.1,28.1 13.45,27.75 U1.11
  Bottom 0.254: U3.6 12.51,27.81 v12.8,28.1
ADC2  (via drill 0.35)
  Top 0.254: U1.8 15.65,29.25 15.7,29.3 15.8,29.4 v15.8,29.5
  Bottom 0.254: R16.2 9.45,37.65 12.2,34.9 12.2,33.2 15.8,29.6 v15.8,29.5
ADC3  (via drill 0.35)
  Top 0.254: U1.9 16.35,28.75 16.7,29.1 16.7,29.8 v16,30.5
  Bottom 0.254: v16,30.5 12.9,33.6 12.9,35.2 12.5,35.6 R17.2
AGND
  Top 0.305: U1.12 11.1,27.25 C9.2 C10.2 R1.1
BIND  (via drill 0.35)
  Top 0.254: U1.27 21.25,20.14 v21,19.9 | v21,16 21,12.8 21.8,12 34.2,12 34.93,12.73 SW2.2
  Bottom 0.254: v21,19.9 v21,16 | R11.1 v36.5,11.5
  pour Top: 35.2,11.4 38,11.4 38,15 35.2,15
BOOT0  (via drill 0.35)
  Top 0.254: U1.60 18.25,33.65 v17.8,33.2
  Bottom 0.254: v17.8,33.2 16.8,33.2 16,34 R2.1
  Bottom 0.406: R2.1 16.65,36.65 18,38 SW1.2
  pour Bottom: 16.3,39 18.7,39 18.7,40.2 16.3,40.2
BOOT1  (via drill 0.35)
  Top 0.254: U1.28 21.75,19.55 20.8,18.6 v20.2,18.6 | R18.1 19.5,15.7 v20,16.2
  Bottom 0.254: v20,16.2 20,18.4 v20.2,18.6
CAN_RX  (via drill 0.35)
  Top 0.254: U1.61 17.74,35.74 18.3,36.3 20.2,36.3 v21,37.1
  Bottom 0.254: U4.4 22.3,40.91 21,39.6 v21,37.1
CAN_TX  (via drill 0.35)
  Top 0.254: U1.62 17.26,36.16 18.2,37.09 v19.5,37.09
  Bottom 0.254: U4.1 23.54,36.44 23.1,36 20.59,36 v19.5,37.09
CANH  (via drill 0.4)
  Top 0.406: D2.1 30.05,38.72 v30.4,38.37
  pour Bottom: 28,38.7 32.5,38.7 32.5,37.7 35,37.7 35,37.2 30.4,37.2 30.4,38 28,38
CANL  (via drill 0.4)
  Top 0.406: D2.2 v33,41
  Bottom 0.406: CON4.2 34.2,39.8 v33,41 31.65,41 R14.2 30.85,40.85 29.64,39.63 U4.6
EXSPI_CS  (via drill 0.35)
  Top 0.254: U1.20 17.74,25.74 18.3,26.3 22.3,26.3 v23.5,27.5
  Bottom 0.254: U3.9 27.89,32.89 27,32 27,31 v23.5,27.5
EXSPI_MISO  (via drill 0.35)
  Top 0.254: U1.22 18.75,24.75 19.1,25.1 23.2,25.1 v23.6,25.5
  Bottom 0.254: U3.11 25.91,27.81 v23.6,25.5
EXSPI_MOSI  (via drill 0.35)
  Top 0.254: U1.23 19.24,24.34 19.5,24.6 v24.5,24.6
  Bottom 0.254: v24.5,24.6 25.17,25.27 U3.12
EXSPI_SCK  (via drill 0.35)
  Top 0.254: U1.21 18.25,25.25 18.7,25.7 22.7,25.7 v23.5,26.5
  Bottom 0.254: v23.5,26.5 27.35,30.35 U3.10
GND  (via drill 0.31, 0.35, 0.4, 0.45)
  Bottom 0.254: R2.2 v16,39.5
  Bottom 0.406: U4.2 25.36,38.37 26.85,39.85 C14.2 v29,43 | U5.GND1 33.4,19.7 v32.9,20.2 | CON1.4 5.8,13.4 6.2,13 v6.8,13
  Bottom 0.61: U3.8 v7.5,32.89 | C15.1 5,25.4 v6,24.4
  other vias: 6.5,43 34,16 38.5,19.5 15,45 8,45 13.5,45 16.5,45
  pour Top (rank 2): -2,-2 42,-2 42,52 -2,52
  pour Bottom: 5,42.6 16,42.6 16,44.5 17,44.5 17,46 7,46 5,44
  pour Bottom: 40,28 32.5,28 32.5,15 40,15
IMU_BARO_CS  (via drill 0.35)
  Top 0.254: U1.2 18.05,32.25 19,31.3 v19,29
  Bottom 0.254: U3.16 18.69,15.11 17.7,16.1 17.7,25.9 19,27.2 v19,29
IMU_MAG_INT  (via drill 0.35)
  Top 0.254: U1.3 17.56,31.74 18,31.3 v18,28.7
  Bottom 0.254: U3.2 15.65,17.65 16.3,18.3 16.3,27 v18,28.7
IMU_MPU_CS  (via drill 0.35)
  Top 0.254: U1.33 24.76,25.24 24.4,25.6 24.4,27.9 23.9,28.4 22.4,28.4 20.9,26.9 18,26.9 v15.2,24.1
  Bottom 0.254: U3.4 13.83,22.73 v15.2,24.1
IMU_MPU_INT  (via drill 0.35)
  Top 0.254: U1.57 19.75,32.95 21.8,30.9 v21.8,30.2
  Bottom 0.254: U3.5 12.27,25.27 15.6,28.6 16.1,28.6 17.95,30.45 20.55,30.45 21,30 21.6,30 v21.8,30.2
IMU_SPI_MISO  (via drill 0.35)
  Top 0.254: U1.35 27.44,26.26 28,25.7 28,23 v27,22
  Bottom 0.254: v27,22 27,19 28.35,17.65 U3.15
IMU_SPI_MOSI  (via drill 0.35)
  Top 0.254: U1.36 28.36,26.74 29,26.1 29,22.5 v28,21.5
  Bottom 0.254: v28,21.5 28,20.4 28.21,20.19 U3.14
IMU_SPI_SCK  (via drill 0.35)
  Top 0.254: U1.34 26.65,25.75 27,25.4 v27,24
  Bottom 0.254: U3.13 27.47,22.73 27,23.2 v27,24
JTCK/SWCLK
  Top 0.254: U1.49 23.76,37.76 TP2.TP
JTDI
  Top 0.254: U1.50 23.25,36.25 23,36.5 TP3.TP
JTDO/SWO
  Top 0.254: U1.55 20.76,35.66 22,36.9 22,38 TP1.TP
JTMS/SWDIO  (via drill 0.35)
  Top 0.254: v27,37.7 TP4.TP | U1.46 24.56,31.74 v24.3,32
  Bottom 0.254: v27,37.7 27,37 24.3,34.3 v24.3,32
LED1  (via drill 0.35)
  Top 0.254: U1.41 31.75,29.25 32.6,28.4 32.6,26.6 36,23.2 36,22 v37.5,20.5 | LED1.C 34.08,16.88 v34.2,17
  Bottom 0.254: v34.2,17 36.2,19 37,19 37.5,19.5 v37.5,20.5
LED2  (via drill 0.35)
  Top 0.254: U1.56 20.25,33.25 23.5,30 v23.5,29.5 | LED2.C 29,19 28,20 25.3,20 25,20.3 v25,22.2
  Bottom 0.254: v25,22.2 22,25.2 22,28 v23.5,29.5
LED3  (via drill 0.35)
  Top 0.254: LED3.C v23,18 | U1.10 15.36,28.24 15.8,27.8 v16.1,27.8
  Bottom 0.254: v16.1,27.8 18.2,29.9 20.1,29.9 20.8,29.2 20.8,26.8 19,25 19,21.5 19.5,21 20.3,21 20.7,21.4 22.4,21.4 23,20.8 v23,18
LED4  (via drill 0.35)
  Top 0.254: U1.25 20.25,22.25 v20,22 | LED4.C 25,17.5 v24.5,18
  Bottom 0.254: v20,22 22.7,22 23.6,21.1 23.6,18.9 v24.5,18
LED5  (via drill 0.35)
  Top 0.254: U1.4 16.74,31.26 v17,31 | LED5.C 27,17.6 26.6,18 v26,18
  Bottom 0.254: v26,18 24.2,19.8 24.2,21.8 21.4,24.6 21.4,28.5 22.7,29.8 22.7,30.5 22.2,31 v17,31
N$1
  Bottom 0.406: U4.3 24.84,39.63 25.15,39.95 C14.1 SJ1.2
N$2
  Top 0.305: U1.6 12.24,30.25 11.3,29.3 X1.3
N$3
  Bottom 0.406: U2.4 13.82,41.83 C2.2
N$4
  Top 0.305: U1.5 12.25,30.75 11.3,31.7 X1.1
N$5
  Top 0.305: U1.31 23.25,22.35 24,21.6 C12.1
N$6
  Top 0.305: U1.47 26.75,32.25 27,32 C13.2
N$7  (via drill 0.35)
  Top 0.254: R3.1 35,25.5 v35.5,25
  Bottom 0.254: U5.D-1 35.65,21.65 36,22 36,23.3 35.5,23.8 v35.5,25
N$8  (via drill 0.35)
  Top 0.254: v37,22.5 R4.1
  Bottom 0.254: U5.D+1 36,21 37,22 v37,22.5
N$9
  Top 0.305: LED1.A R5.1
N$10
  Top 0.305: LED3.A R7.1
N$11
  Top 0.305: LED4.A R8.1
N$12
  Top 0.305: LED5.A R9.1
N$13
  Top 0.305: LED2.A R6.1
N$14
  Top 0.305: CON5.3 7.03,37.62 8.56,39.16 FIL1.1
N$15
  Top 0.406: SJ3.2 22.5,42.5 23.2,43.2 RC1.1
N$16
  Top 0.305: CON5.2 7.17,36.38 8.64,37.84 FIL1.3
N$17
  Bottom 0.406: R12.4 24.36,11.2 JP3.5
N$18
  Bottom 0.406: R12.3 26.1,10.4 JP3.6
N$19
  Bottom 0.406: R12.2 27.84,9.6 JP3.7
N$20
  Bottom 0.406: R12.1 29.58,8.8 JP3.8
N$21
  Top 0.406: JP3.4 18.62,9.38 17.7,10.3 R13.8
N$22
  Top 0.406: R13.7 15.1,8.98 JP3.3
N$23
  Top 0.406: R13.6 14.3,8.76 JP3.2
N$24
  Top 0.305: R10.1 LED6.A
N$25
  Top 0.406: JP3.1 11,9.3 12,10.3 R13.5
N$26  (via drill 0.35)
  Top 0.254: FIL1.5 11.46,39.53 11,40 v10.5,40
  Bottom 0.254: R16.1 9.35,39.35 10,40 v10.5,40
N$27  (via drill 0.35)
  Top 0.305: FIL1.4 12.24,37.84 12.5,38.1 v12.5,40.5
  Bottom 0.305: R17.1 v12.5,40.5
N$28  (via drill 0.4)
  Top 0.254: FIL2.1 7.46,20.66 v7,20.2
  Bottom 0.254: v7,20.2 7,18.6 7.4,18.2 7.4,17 7.03,16.62 CON1.2
N$29  (via drill 0.4)
  Top 0.254: FIL2.3 8.24,19.34 v7.9,19
  Bottom 0.254: v7.9,19 7.9,16.1 7.17,15.38 CON1.3
N$30
  Top 0.305: FIL3.4 32.04,35.84 32.58,36.38 CON2.3
N$31
  Top 0.305: FIL3.5 31.96,37.16 32.42,37.62 CON2.2
N$32  (via drill 0.4)
  Top 0.61: CON5.4 4.38,38.88 v4,38.5
  Bottom 0.61: v4,38.5 D3.A
N$33
  Bottom 0.406: CON1.1 5.8,18.1
  Bottom 0.61: 5.8,18.1 SJ2.2
N$34
  Top 0.406: RC2.1 SJ4.2
NRST
  Top 0.305: U1.7 13.16,29.76 11.7,28.3 5,28.3 | C11.2 5,28.3 | 5,28.3 TP5.TP
PWM1  (via drill 0.35)
  Top 0.254: U1.37 29.45,27.25 30,26.7 30,20.2 v32.2,18
  Bottom 0.254: v32.2,18 32.2,14.5 32.7,14 R12.5
PWM2  (via drill 0.35)
  Top 0.254: U1.38 30.14,27.75 30.9,27 30.9,21.1 v33,19
  Bottom 0.254: v33,19 33,15 33.6,14.4 33.6,10.7 33.3,10.4 R12.6
PWM3  (via drill 0.35)
  Top 0.254: U1.39 30.76,28.24 31.5,27.5 31.5,22.5 32.7,21.3 34.7,21.3 36,20 36,16.7 34.3,15 v34.3,13.7
  Bottom 0.254: R12.7 33.6,9.6 34.3,10.3 v34.3,13.7
PWM4  (via drill 0.35)
  Top 0.254: U1.40 31.25,28.75 32,28 32,23 33.2,21.8 35.2,21.8 36.5,20.5 36.5,15.7 v35.5,14.7
  Bottom 0.254: R12.8 33.8,8.8 35,10 35,12.5 35.5,13 v35.5,14.7
PWM5  (via drill 0.35)
  Top 0.254: U1.14 13.26,26.26 12.1,25.1 v12.1,21.4 | v12.1,18.4 v12.1,14.6 | R13.4 12.6,11.7 v12.3,12
  Bottom 0.254: v12.1,21.4 v12.1,18.4 | v12.1,14.6 12.1,12.2 v12.3,12
PWM6  (via drill 0.35)
  Top 0.254: U1.15 13.45,25.75 13,25.3 v13,21.9 | v13,19 v13,16 | R13.3 14.3,12.7 v13.7,13.3
  Bottom 0.254: v13,21.9 v13,19 | v13,16 13,14 v13.7,13.3
S1CL_PWM7  (via drill 0.35)
  Top 0.254: U1.58 19.24,32.66 21,30.9 21,28.9 v20,27.9 | R13.2 15.1,12.6 15.5,13 17.1,13 17.9,13.8 17.9,15.7 v18.7,16.5
  Bottom 0.254: v20,27.9 20,27 18.4,25.4 18.4,18.4 18.7,18.1 v18.7,16.5
S1DA_PWM8  (via drill 0.35)
  Top 0.254: U1.59 18.75,32.34 20,31.1 20,28.9 18.8,27.7 v18,27.7 | R13.1 16.7,11.7 v17,12
  Bottom 0.254: v17,12 17,26.7 v18,27.7
S2CL_U3TX
  Top 0.254: U6.4 20.91,17.91 22.26,19.26 U1.29
S2DA_U3RX
  Top 0.254: U6.1 17.2,14.1 17.3,14.2 17.3,16.5 18.1,17.3 21,17.3 22.74,19.04 U1.30
SRV_COM
  Top 0.813: JP1.1 JP1.2 JP1.3 JP1.4 JP1.5 JP1.6 JP1.7 JP1.8 JP1.9
UART1_RX  (via drill 0.35)
  Top 0.254: RC1.2 26,41 | 26,41 26,37 v25,36 | D5.C 26,41 | U1.43 24.75,30.25 v24,31
  Bottom 0.254: v25,36 23.5,34.5 23.5,31.5 v24,31
UART2_RX
  Top 0.254: U1.17 15.69,23.39 15,22.7 15,21 13.9,19.9 12.7,19.9 12.14,19.34 FIL2.4
UART2_TX
  Top 0.254: U1.16 14.39,21.39 13.66,20.66 FIL2.5
UART3_RX
  Top 0.254: U1.52 22.26,33.34 22.8,32.8 24,32.8 27.04,35.84 FIL3.3
UART3_TX
  Top 0.254: U1.51 22.74,33.66 23,33.4 23.9,33.4 27.66,37.16 FIL3.1
UART5_RX  (via drill 0.31, 0.35)
  Top 0.254: v15,39.5 15,41 | 15,41 RC2.2 | D6.C 15,41 | U1.54 21.25,33.26 v21.5,33
  Bottom 0.254: v15,39.5 15,33.2 15.8,32.4 21.2,32.4 21.5,32.7 v21.5,33
USB_VBUS  (via drill 0.35)
  Top 0.254: U1.42 32.24,29.76 33.5,28.5 v33.5,28.2
  Bottom 0.305: v33.5,28.2 36.6,28.2 37.05,27.75 D1.4
  Bottom 0.406: D4.A v33.5,28.2 33.5,24.5 33,24 33,22.7 33.4,22.3 U5.VBUS1
USBDM  (via drill 0.4)
  Top 0.254: U1.44 26.95,30.75 27.4,30.3 34.7,30.3 v35,30 R3.2
  Bottom 0.305: D1.2 34.95,29.95 v35,30
USBDP  (via drill 0.4)
  Top 0.254: U1.45 27.24,31.26 27.6,30.9 36.1,30.9 v37,30 R4.2
  Bottom 0.305: D1.3 37.05,29.95 v37,30
VDDA
  Top 0.305: U1.13 12.94,26.74 11.65,25.45 C9.1 C10.1 L1.2

### Text on the board
tPlace: GPS | PWR | B A | BIND | - +
bPlace: BOOT | L | H | TELE | 5 | 6 | 7CL | 8DA | 1 | 2 | 3 | 4